# EAGLE design projeto final (EAGLE 4.16)
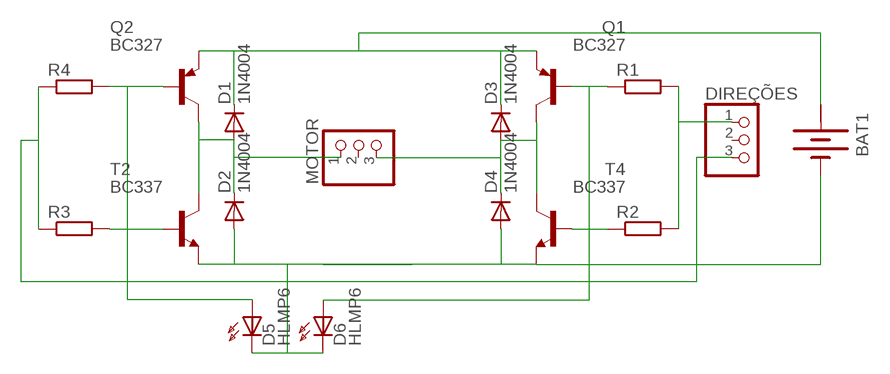
[diagram p0: schematic, sheet 1]

## Parts
BAT1  BATTERY  [BATTERY]
D1  1N4004  [DO41-10]
D2  1N4004  [DO41-10]
D3  1N4004  [DO41-10]
D4  1N4004  [DO41-10]
D5  HLMP6  [HLMP6]
D6  HLMP6  [HLMP6]
DIREÇÕES  PINHD-1X3  [1X03]
MOTOR  PINHD-1X3  [1X03]
Q1  BC327  [TO92]
Q2  BC327  [TO92]
R1  R-EU_0204/5  [0204/5]
R2  R-EU_0204/5  [0204/5]
R3  R-EU_0204/5  [0204/5]
R4  R-EU_0204/5  [0204/5]
T2  BC337  [TO92]
T4  BC337  [TO92]

## Nets
N$1: R3.2 T2.2(B)
N$2: R2.1 T4.2(B)
N$3: D6.A Q1.2(B) R1.1
N$4: D1.A D2.C MOTOR.1 Q2.3(C) T2.3(C)
N$5: D3.A D4.C MOTOR.3 Q1.3(C) T4.3(C)
N$7: DIREÇÕES.1 R1.2 R2.2
N$8: D5.A Q2.2(B) R4.2
N$9: BAT1.- D2.A D4.A D5.K D6.K T2.1(E) T4.1(E)
N$10: BAT1.+ D1.C D3.C Q1.1(E) Q2.1(E)
N$11: DIREÇÕES.3 R3.1 R4.1
Unconnected: DIREÇÕES.2 MOTOR.2

## Power pins joined to a net without a drawn wire
+: BAT1.+@1(+)

## Library data of the parts
BAT1 = special:BATTERY: BATTERY
D1-D4 = diode:1N4004: DIODE general purpose rectifier, 1 A
D5 D6 = display-hp:HLMP6: LED 2mm horizontal
DIREÇÕES MOTOR = pinhead:PINHD-1X3: PIN HEADER
Q1 Q2 = transistor-pnp:BC327: PNP Transistor
R1-R4 = rcl:R-EU_: RESISTOR, European symbol
T2 T4 = transistor:BC337: NPN TRANSISTOR

## Board
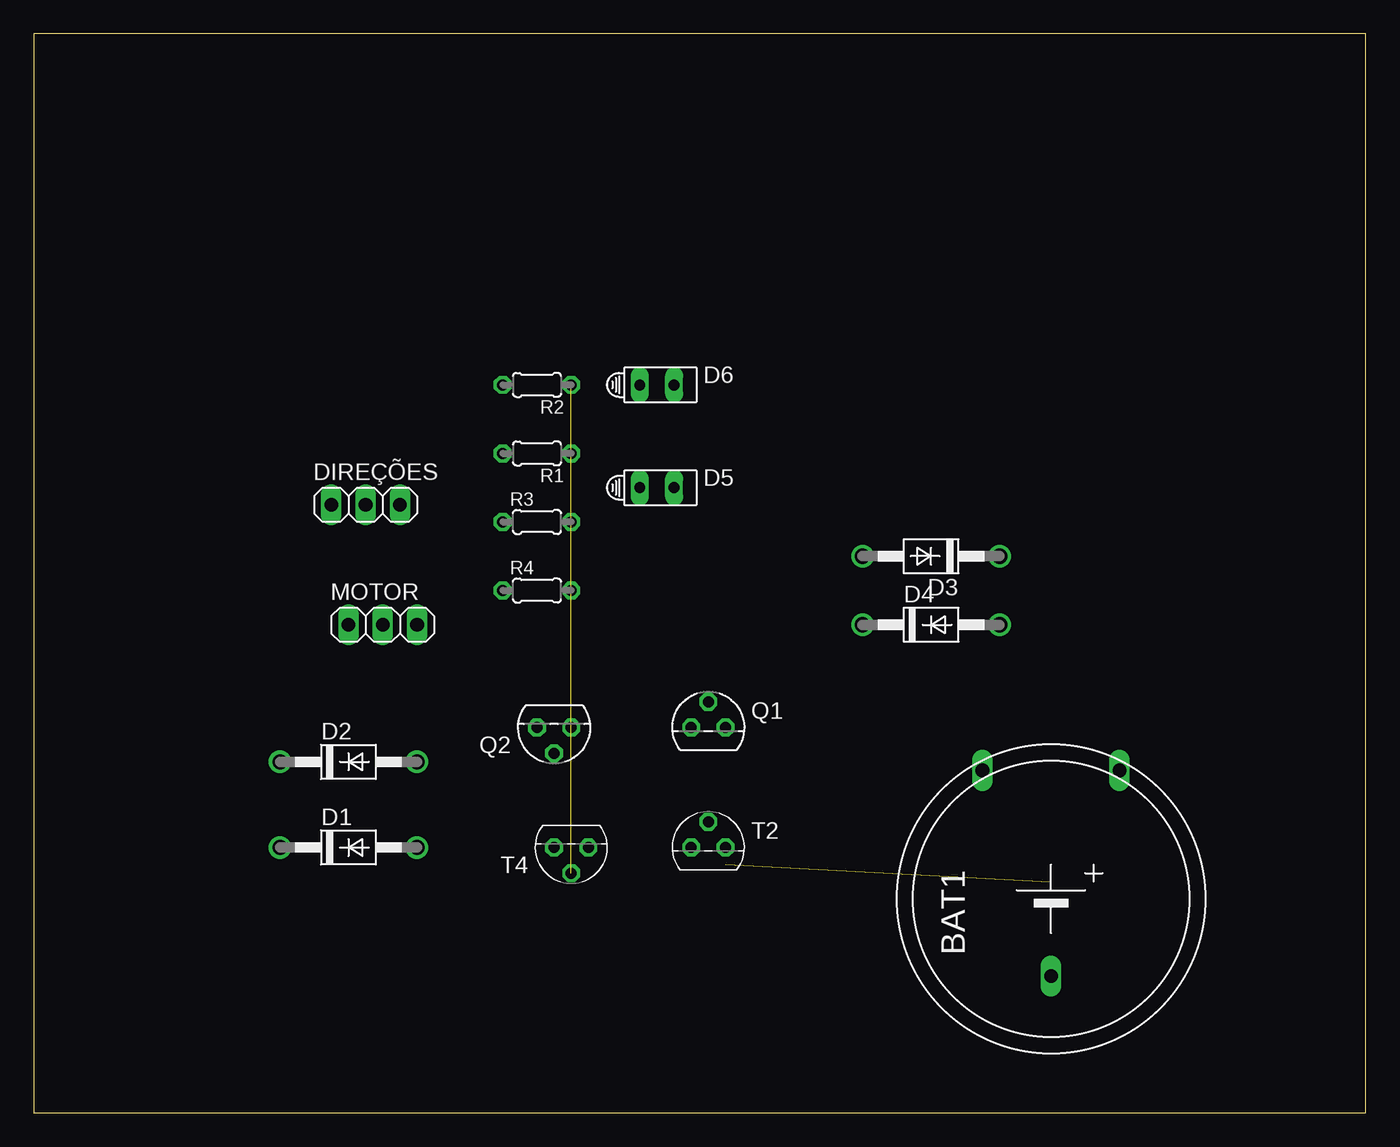
[diagram p1: board, top side]
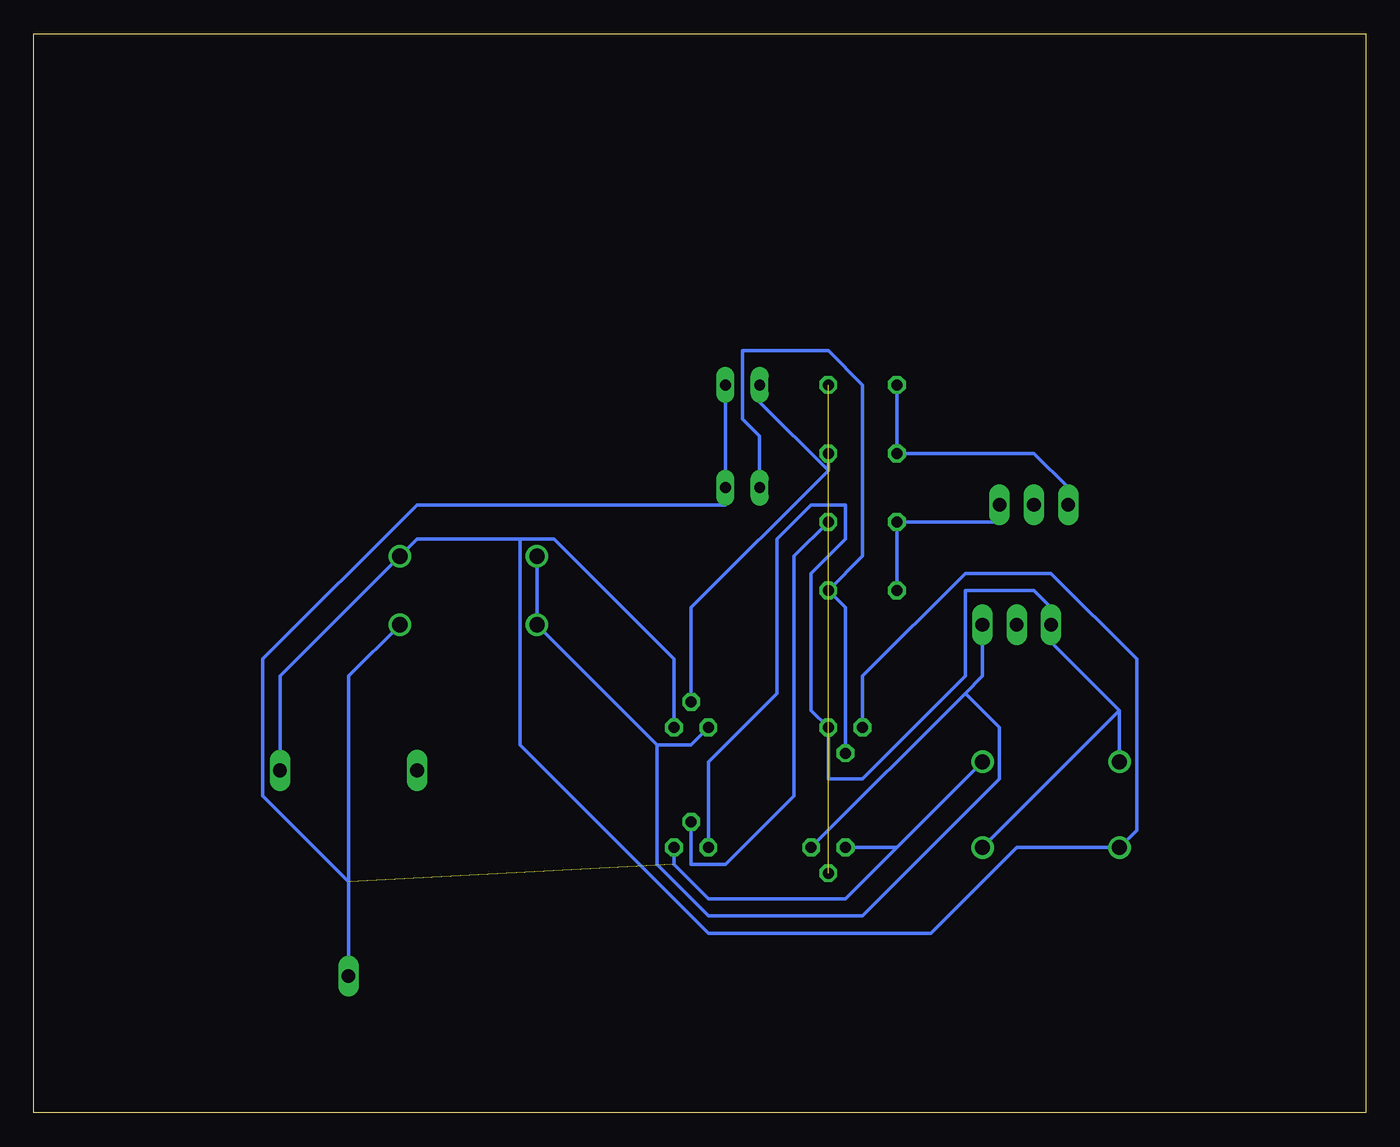
[diagram p2: board, bottom side, seen from below]

Size 98.73 x 80 mm. Coordinates in mm from the lower left corner, seen from the top.
Outline: 0,0 98.73,0 98.73,80 0,80 0,0
Copper layers (1*16): Top 0.035mm / dielectric 1.5mm / Bottom 0.035mm
Design rules "default": minimum track width 10mil, minimum drill 24mil, track to track 40mil, track to pad 40mil, pad to pad 8mil, via to via 8mil, smd to smd 8mil, copper to edge 40mil, drill to drill 8mil, minimum pad ring 10mil, minimum via ring 8mil, stop-mask expansion 4mil, vias tented up to drill 0mil, thermal gap 10mil

### Footprints (pad centres in the part's own frame; a part is rotated, then mirrored left to right if it is on the bottom)
BATTERY = drill 1.016 long: + 9.525,-5.08; +@1 9.525,5.08; - -5.715,0
DO41-10 = drill 1.118 round: A 5.08,0; C -5.08,0
HLMP6 = drill 0.813 long: A -1.27,0; K 1.27,0
1X03 = drill 1.016 long: 1 -2.54,0; 2 0,0; 3 2.54,0
TO92 = drill 0.813 octagon: 1 1.27,0; 2 0,1.905; 3 -1.27,0
0204/5 = drill 0.813 octagon: 1 -2.54,0; 2 2.54,0

### Placement (x,y rotation side)
BAT1  75.4,15.87 90 top
D1  23.33,19.68 0 top
D2  23.33,26.03 0 top
D3  66.51,41.27 180 top
D4  66.51,36.19 0 top
D5  46.19,46.35 0 top
D6  46.19,53.97 0 top
DIREÇÕES  24.6,45.08 0 top
MOTOR  25.87,36.19 0 top
Q1  50,28.57 0 top
Q2  38.57,28.57 180 top
R1  37.3,48.89 180 top
R2  37.3,53.97 180 top
R3  37.3,43.81 0 top
R4  37.3,38.73 0 top
T2  50,19.68 0 top
T4  39.84,19.68 180 top

### Tracks (layer width: path | path; a pad name or v marks a point on that pad's centre or on a via)
N$1
  Bottom 0.254: R3.2 42.38,41.27 42.38,23.49 47.46,18.41 50,18.41 T2.2
N$2  (1 unrouted)
N$3
  Bottom 0.254: 39.84,47.62 50,37.46 Q1.2 | 39.84,47.62 R1.1 | 39.84,47.62 44.92,52.7 D6.A
N$4
  Bottom 0.254: T2.3 48.73,26.03 43.65,31.11 43.65,42.54 41.11,45.08 38.57,45.08 38.57,42.54 41.11,40 41.11,29.84 Q2.3 39.84,24.76 37.3,24.76 29.68,32.38 29.68,38.73 24.6,38.73 23.33,37.46 MOTOR.1 23.33,34.92 18.25,29.84 | D2.C 18.25,29.84 | 18.25,29.84 D1.A
N$5
  Bottom 0.254: Q1.3 50,27.3 52.54,27.3 | 52.54,27.3 D4.C D3.A | 29.68,31.11 28.41,32.38 MOTOR.3 | 29.68,31.11 T4.3 | 52.54,27.3 52.54,18.41 48.73,14.6 37.3,14.6 27.14,24.76 27.14,28.57 29.68,31.11
N$7
  Bottom 0.254: R2.2 R1.2 24.6,48.89 22.06,46.35 DIREÇÕES.1
N$8
  Bottom 0.254: Q2.2 38.57,37.46 R4.2 37.3,41.27 37.3,53.97 39.84,56.51 46.19,56.51 46.19,51.43 44.92,50.16 D5.A
N$9  (1 unrouted)
  Bottom 0.254: 34.76,19.68 T4.1 | 34.76,19.68 D2.A | T2.1 51.27,18.41 48.73,15.87 38.57,15.87 34.76,19.68 | D6.K D5.K 47.46,45.08 70.32,45.08 81.75,33.65 81.75,23.49 75.4,17.14 | 75.4,17.14 75.4,32.38 D4.A | BAT1.- 75.4,17.14
N$10
  Bottom 0.254: Q2.1 37.3,32.38 29.68,40 23.33,40 16.98,33.65 16.98,20.95 D1.C 25.87,19.68 32.22,13.33 48.73,13.33 62.7,27.3 62.7,42.54 | Q1.1 51.27,33.65 60.16,42.54 62.7,42.54 | 62.7,42.54 70.32,42.54 D3.C 80.48,32.38 BAT1.+
N$11
  Bottom 0.254: R4.1 R3.1 27.14,43.81 DIREÇÕES.3